# EAGLE board PCB - alu40 (EAGLE 9.6.2)
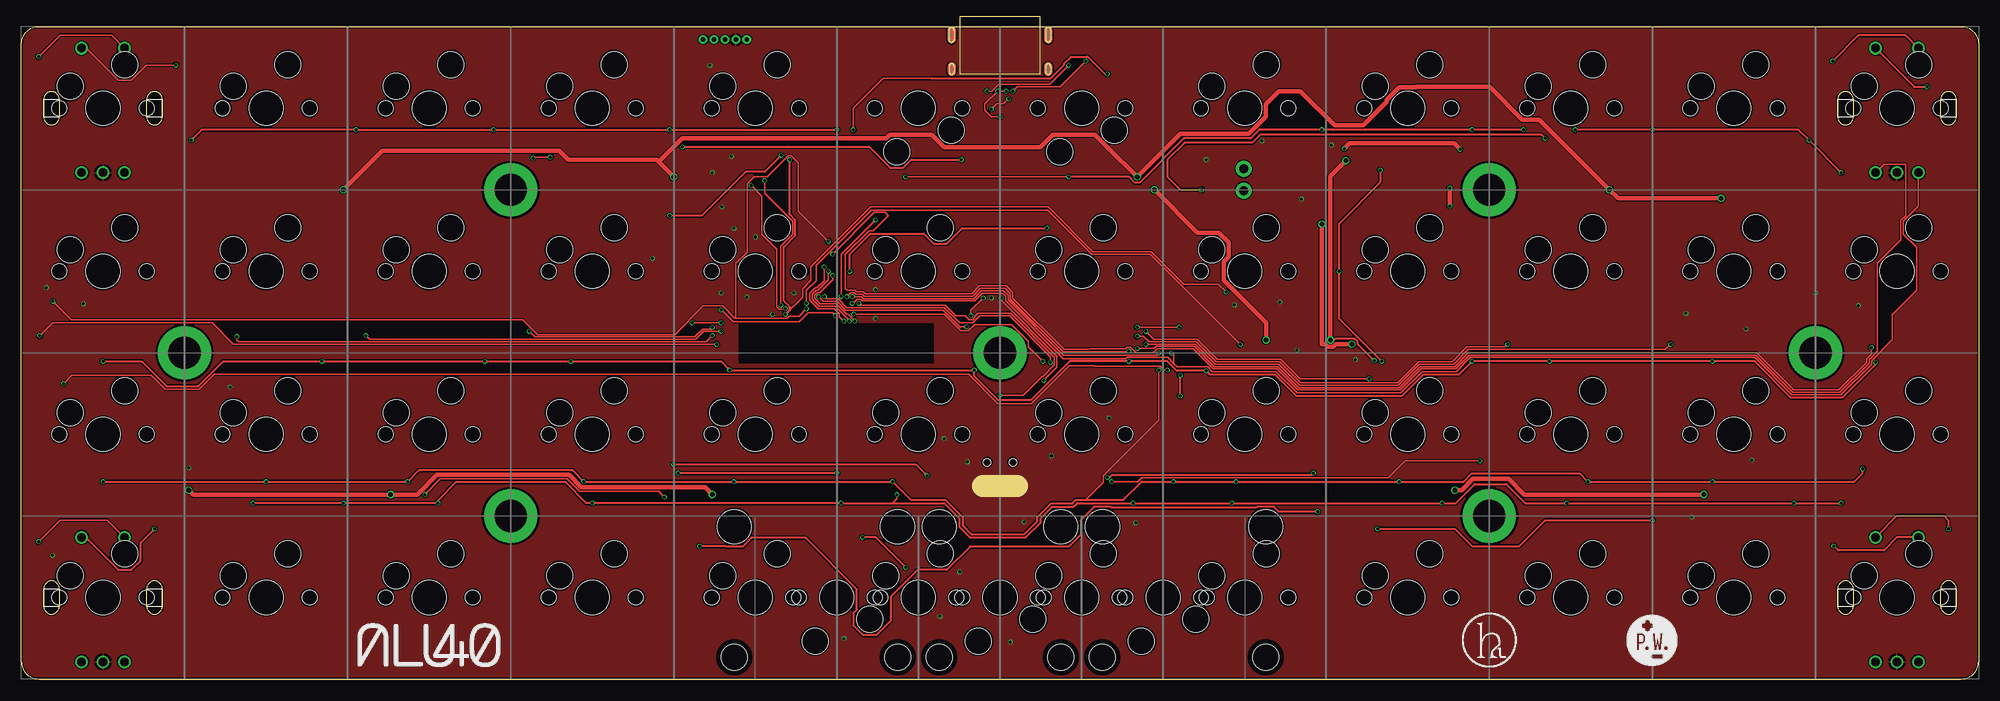
[diagram p2: board, top side]
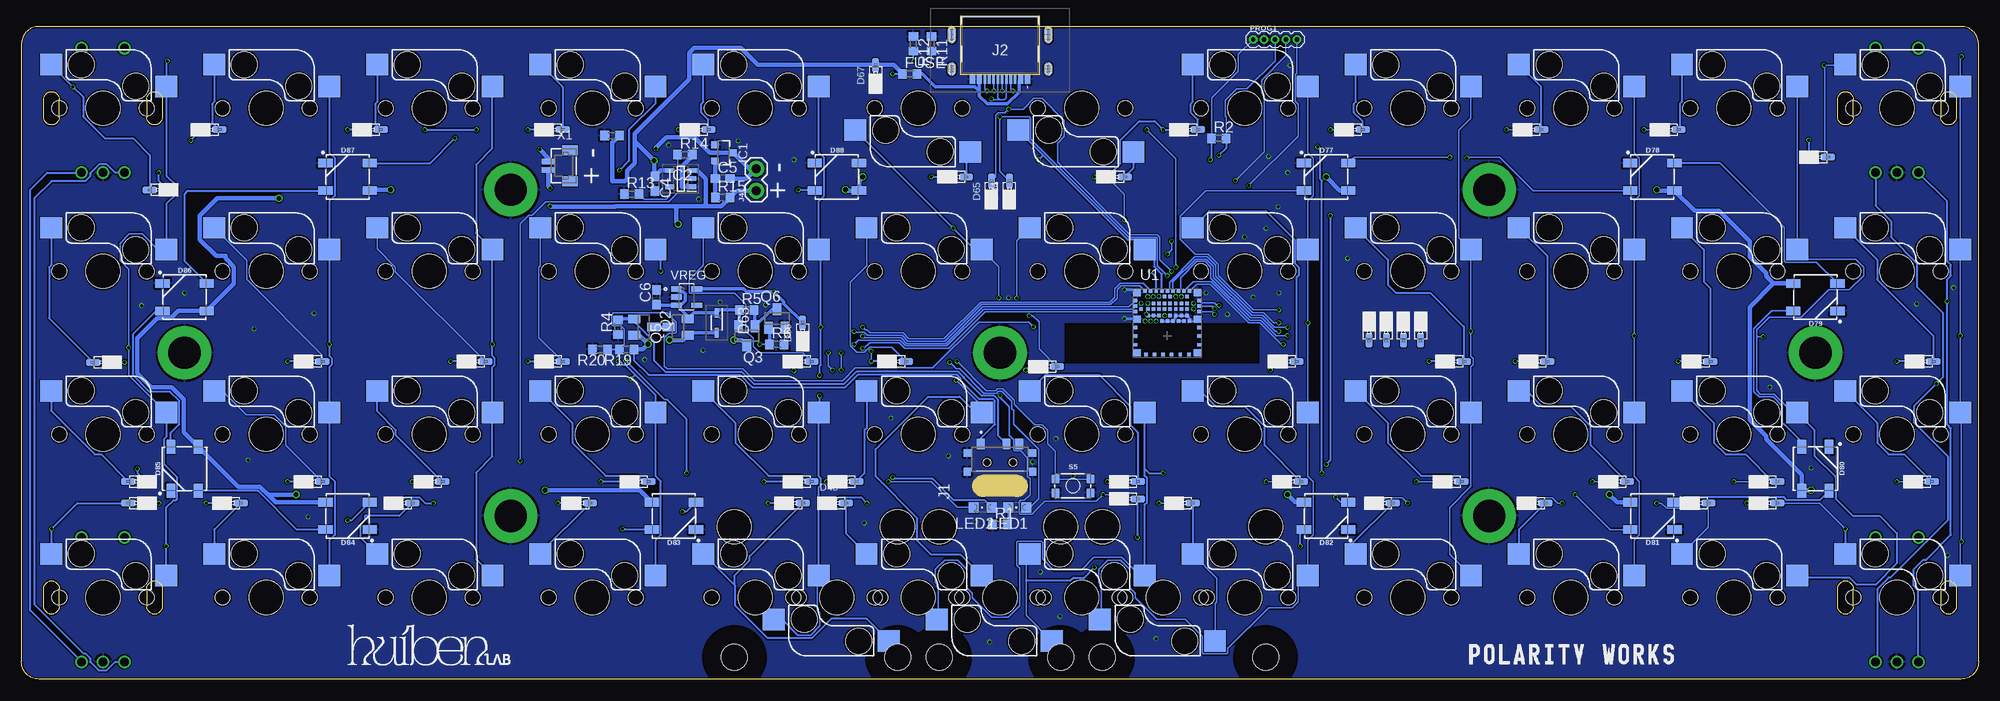
[diagram p3: board, bottom side, seen from below]

Size 228 x 76 mm. Coordinates in mm from the lower left corner, seen from the top.
Outline: 2,0 226,0 arc90 228,2 228,74 arc90 226,76 2,76 arc90 0,74 0,2 arc90 2,0
Copper layers (1*16): Top 0.035559375mm / dielectric 1.6mm / Bottom 0.035559375mm
Design rules "jlcpcb2layer": minimum track width 5mil, minimum drill 12mil, track to track 5mil, track to pad 5mil, pad to pad 5mil, via to via 5mil, smd to smd 5mil, copper to edge 8mil, drill to drill 6mil, minimum pad ring 5mil, minimum via ring 3mil, stop-mask expansion 2.5mil, vias tented up to drill 0mil, thermal gap 10mil
tRestrict: area 83.6,36.8 to 106.3,41.5; 1 lines
bRestrict: area 83.8,36.8 to 106.5,41.5; 1 lines
Milling: 1 lines

## Footprints (pad centres in the part's own frame; a part is rotated, then mirrored left to right if it is on the bottom)
CHERRY = smd 2.55 x 2.5 bottom: 1 6.05,5.08; 2 -7.37,2.54 | hole 3.988: 0,0 | hole 1.753: 5.08,0; -5.08,0 | hole 3.048: -3.81,2.54; 2.54,5.08
ENCODER = drill 0.991: A -2.5,-7.5; B 2.5,-7.5; GND 0,-7.5; S1 -2.5,7; S2 2.5,7
C0603 = smd 1.1 x 1: 1 -0.85,0; 2 0.85,0
SOD-323 = smd 1.676 x 0.813: A 1.04,0; C -1.04,0
SOD2713X115N = smd 1.125 x 0.5: 1 -1.162,0; 2 1.162,0
WS2812B = smd 1.651 x 1: 1 2.577,-1.6; 2 2.577,1.6; 3 -2.577,1.6; 4 -2.577,-1.6
R0603 = smd 1 x 1.1: 1 -0.85,0; 2 0.85,0
SOT23-3 = smd 0.8 x 0.9: 1 -0.95,-1; 2 0.95,-1; 3 0,1.1
SOT95P280X100-5N = smd 1.05 x 0.55: 1 -1.3,0.95; 2 -1.3,0; 3 -1.3,-0.95; 4 1.3,-0.95; 5 1.3,0.95
SK3296S01L1 = smd 0.9 x 1.2: 1 2.25,-0.9; 2 -0.75,-0.9; 3 -2.25,-0.9 | smd 0.8 x 0.9: MP1 -3.8,0.15; MP2 3.8,0.15; MP3 3.8,2.35; MP4 -3.8,2.35 | hole 0.9: -1.5,1.25; 1.5,1.25
USB4510031A = smd 0.6 x 1.1: A1 -3.2,4; A4 -2.4,4; A9 2.4,4; A12 3.2,4 | smd 0.3 x 1.1: A5 -1.25,4; A6 -0.25,4; A7 0.25,4; A8 1.25,4; B5 1.75,4; B6 0.75,4; B7 -0.75,4; B8 -1.75,4 | smd 1 x 1.6: SHLD1 5.621,2.834; SHLD5 -5.622,2.834 | smd 1 x 1.6 bottom: SHLD2 5.621,2.834; SHLD6 -5.622,2.834 | smd 1 x 2.1: SHLD3 -5.646,-1.161; SHLD7 5.62,-1.161 | smd 1 x 2.1 bottom: SHLD4 -5.646,-1.161; SHLD8 5.62,-1.161
1X02 = drill 1.016 pad 1.88: 1 0,0; 2 2.54,0
CHIPLED_0805 = smd 1.2 x 1.2: A 0,-1.05; C 0,1.05
1X05_1.27MM = drill 0.508 pad 1: 1 0,0; 2 1.27,0; 3 2.54,0; 4 3.81,0; 5 5.08,0
SOT23 = smd 1 x 1.4: 1 -0.95,-1.1; 2 0.95,-1.1; 3 0,1.1
TACTILE_SWITCH_SMD_4.6X2.8MM = smd 0.9 x 1: 1 -2.05,-0.8; 2 2.05,-0.8; 3 2.05,0.8; 4 -2.05,0.8
ISP1807-LR = smd 0.8 x 0.8: 1 0.5,-0.5; 7 0.5,-3.6; 25 7.5,-3.6; 31 7.5,-0.5; 68 0.5,-7.5; 75 7.5,-7.5 | smd 0.4 x 0.4: 2 0.3,-1.4; 3 0.95,-1.725; 4 0.3,-2.05; 5 0.95,-2.375; 6 0.3,-2.7; 8 1.4,-3.8; 9 1.725,-3.15; 10 2.05,-3.8; 11 2.375,-3.15; 12 2.7,-3.8; 13 3.025,-3.15; 14 3.35,-3.8; 15 3.675,-3.15; 16 4,-3.8; 17 4.325,-3.15; 18 4.65,-3.8; 19 4.975,-3.15; 20 5.3,-3.8; 21 5.625,-3.15; 22 5.95,-3.8; 23 6.275,-3.15; 24 6.6,-3.8; 26 7.7,-2.7; 27 7.05,-2.375; 28 7.7,-2.05; 29 7.05,-1.725; 30 7.7,-1.4; 32 6.6,-0.3; 33 6.275,-0.95; 34 5.95,-0.3; 35 5.625,-0.95; 36 5.3,-0.3; 37 4.975,-0.95; 38 4.65,-0.3; 39 4.325,-0.95; 40 4,-0.3; 41 3.675,-0.95; 42 3.35,-0.3; 43 3.025,-0.95; 44 2.7,-0.3; 45 2.375,-0.95; 46 2.05,-0.3; 47 1.725,-0.95; 48 1.4,-0.3; 49 6.275,-1.725; 50 5.625,-1.725; 51 4.975,-1.725; 52 4.325,-1.725; 53 3.675,-1.725; 54 3.025,-1.725; 55 2.375,-1.725; 56 1.725,-1.725; 57 6.275,-2.375; 58 5.625,-2.375; 59 4.975,-2.375; 60 4.325,-2.375; 61 3.675,-2.375; 62 3.025,-2.375; 63 2.375,-2.375; 64 1.725,-2.375; 65 0.3,-4.55; 66 0.3,-5.55; 67 0.3,-6.55; 69 1.5,-7.7; 70 2.5,-7.7; 71 3.5,-7.7; 72 4.5,-7.7; 73 5.5,-7.7; 74 6.5,-7.7; 76 7.7,-6.55; 77 7.7,-5.55; 78 7.7,-4.55
SINSOOM2 = drill 3.75 pad 6.2: P$1 0,0
STAB-2U = hole 3.988: -11.938,-8.255; 11.938,-8.255 | hole 3.048: -11.938,6.985; 11.938,6.985
SOT95P285X140-5N = smd 1.35 x 0.6: 1 -1.185,0.95; 2 -1.185,0; 3 -1.185,-0.95; 4 1.185,-0.95; 5 1.185,0.95
BM02B-SRSS-TB = smd 0.6 x 1.55: 1 0.5,0; 2 -0.5,0 | smd 1.2 x 1.8: M1 1.8,-2.525; M2 -1.8,-2.525

## Placement (x,y rotation side)
11  [CHERRY]  9.5,66.5 0 top
11ENC  ENCODERHOLE  [ENCODER]  9.5,66.5 0 top
12  [CHERRY]  28.5,66.5 0 top
13  [CHERRY]  47.5,66.5 0 top
14  [CHERRY]  66.5,66.5 0 top
15  [CHERRY]  85.5,66.5 0 top
16  [CHERRY]  104.5,66.5 180 top
17  [CHERRY]  123.5,66.5 180 top
18  [CHERRY]  142.5,66.5 0 top
19  [CHERRY]  161.5,66.5 0 top
21  [CHERRY]  9.5,47.5 0 top
22  [CHERRY]  28.5,47.5 0 top
23  [CHERRY]  47.5,47.5 0 top
24  [CHERRY]  66.5,47.5 0 top
25  [CHERRY]  85.5,47.5 0 top
26  [CHERRY]  104.5,47.5 0 top
27  [CHERRY]  123.5,47.5 0 top
28  [CHERRY]  142.5,47.5 0 top
29  [CHERRY]  161.5,47.5 0 top
31  [CHERRY]  9.5,28.5 0 top
32  [CHERRY]  28.5,28.5 0 top
33  [CHERRY]  47.5,28.5 0 top
34  [CHERRY]  66.5,28.5 0 top
35  [CHERRY]  85.5,28.5 0 top
36  [CHERRY]  104.5,28.5 0 top
37  [CHERRY]  123.5,28.5 0 top
38  [CHERRY]  142.5,28.5 0 top
39  [CHERRY]  161.5,28.5 0 top
41  [CHERRY]  9.5,9.5 0 top
41ENC\  ENCODERHOLE  [ENCODER]  9.5,9.5 0 top
42  [CHERRY]  28.5,9.5 0 top
43  [CHERRY]  47.5,9.5 0 top
44  [CHERRY]  66.5,9.5 0 top
45  [CHERRY]  85.5,9.5 0 top
45-2  [CHERRY]  95,9.5 180 top
46  [CHERRY]  104.5,9.5 0 top
46-2  [CHERRY]  114,9.5 180 top
47  [CHERRY]  123.5,9.5 0 top
48  [CHERRY]  142.5,9.5 0 top
48-2  [CHERRY]  133,9.5 180 top
49  [CHERRY]  161.5,9.5 0 top
110  [CHERRY]  180.5,66.5 0 top
111  [CHERRY]  199.5,66.5 0 top
112  [CHERRY]  218.5,66.5 0 top
112ENC  ENCODERHOLE  [ENCODER]  218.5,66.5 0 top
210  [CHERRY]  180.5,47.5 0 top
211  [CHERRY]  199.5,47.5 0 top
212  [CHERRY]  218.5,47.5 0 top
310  [CHERRY]  180.5,28.5 0 top
311  [CHERRY]  199.5,28.5 0 top
312  [CHERRY]  218.5,28.5 0 top
410  [CHERRY]  180.5,9.5 0 top
411  [CHERRY]  199.5,9.5 0 top
412  [CHERRY]  218.5,9.5 0 top
412ENC  ENCODERHOLE  [ENCODER]  218.5,9.5 0 top
C4  10u  [C0603]  154.2,57.7 270 bottom
C5  100n  [C0603]  146.3,58.3 0 bottom
C6  4.7u  [C0603]  154,44.5 90 bottom
D1  1N4148WS  [SOD-323]  18.6,60.8 0 bottom
D2  1N4148WS  [SOD-323]  36,64 0 bottom
D3  1N4148WS  [SOD-323]  52,64 0 bottom
D4  1N4148WS  [SOD-323]  72.8,64 0 bottom
D5  1N4148WS  [SOD-323]  92,64 0 bottom
D6  1N4148WS  [SOD-323]  100.5,58.5 0 bottom
D7  1N4148WS  [SOD-323]  119,58.5 0 bottom
D8  1N4148WS  [SOD-323]  149,64 0 bottom
D9  1N4148WS  [SOD-323]  166,64 0 bottom
D10  1N4148WS  [SOD-323]  187.2,64 0 bottom
D11  1N4148WS  [SOD-323]  206,64 0 bottom
D12  1N4148WS  [SOD-323]  212,57 180 bottom
D13  1N4148WS  [SOD-323]  6.3,37 0 bottom
D14  1N4148WS  [SOD-323]  32.3,37 0 bottom
D15  1N4148WS  [SOD-323]  51.3,37 0 bottom
D16  1N4148WS  [SOD-323]  61,37 0 bottom
D17  1N4148WS  [SOD-323]  80.5,37 0 bottom
D18  1N4148WS  [SOD-323]  108.4,36.4 0 bottom
D19  1N4148WS  [SOD-323]  126,37 0 bottom
D20  1N4148WS  [SOD-323]  137,37 0 bottom
D21  1N4148WS  [SOD-323]  166,37 0 bottom
D22  1N4148WS  [SOD-323]  175,37 0 bottom
D23  1N4148WS  [SOD-323]  194,37 0 bottom
D24  1N4148WS  [SOD-323]  218.6,36.9 180 bottom
D25  1N4148WS  [SOD-323]  6.5,23 0 bottom
D26  1N4148WS  [SOD-323]  24.5,23 0 bottom
D27  1N4148WS  [SOD-323]  42,23 0 bottom
D28  1N4148WS  [SOD-323]  61.3,23 0 bottom
D29  1N4148WS  [SOD-323]  80,23 0 bottom
D30  1N4148WS  [SOD-323]  99,23 0 bottom
D31  1N4148WS  [SOD-323]  131.8,23 0 bottom
D32  1N4148WS  [SOD-323]  137,23 0 bottom
D33  1N4148WS  [SOD-323]  156,23 0 bottom
D34  1N4148WS  [SOD-323]  180,23 0 bottom
D35  1N4148WS  [SOD-323]  194,23 0 bottom
D36  1N4148WS  [SOD-323]  214.5,23 180 bottom
D37  1N4148WS  [SOD-323]  24.5,20.5 0 bottom
D38  1N4148WS  [SOD-323]  32.5,20.5 0 bottom
D39  1N4148WS  [SOD-323]  51.5,20.5 0 bottom
D40  1N4148WS  [SOD-323]  69.3,20.5 0 bottom
D41  1N4148WS  [SOD-323]  92.6,20.5 0 bottom
D42  1N4148WS  [SOD-323]  99,21 0 bottom
D43  1N4148WS  [SOD-323]  138,20.5 0 bottom
D44  1N4148WS  [SOD-323]  162.8,20.5 0 bottom
D45  1N4148WS  [SOD-323]  183.5,20.5 0 bottom
D46  1N4148WS  [SOD-323]  203.5,20.5 0 bottom
D47  1N4148WS  [SOD-323]  214.5,20.5 180 bottom
D48  1N4148WS  [SOD-323]  133,20.5 0 bottom
D49  1N4148WS  [SOD-323]  65,40.5 270 bottom
D50  1N4148WS  [SOD-323]  67,40.5 270 bottom
D51  1N4148WS  [SOD-323]  69,40.5 270 bottom
D52  1N4148WS  [SOD-323]  71,40.5 270 bottom
D63  SD103AWS-E3-08  [SOD2713X115N]  147,41.5 270 bottom
D64  ESDSOD323  [SOD-323]  112.9,57 90 bottom
D65  ESDSOD323  [SOD-323]  115,57 90 bottom
D66  ESDSOD323  [SOD-323]  137,40.5 90 bottom
D67  ESDSOD323  [SOD-323]  128.5,70.5 90 bottom
D77  WS2812B  [WS2812B]  76,58.5 0 bottom
D78  WS2812B  [WS2812B]  38,58.5 0 bottom
D79  WS2812B  [WS2812B]  19,44.5 180 bottom
D80  WS2812B  [WS2812B]  19,24.5 270 bottom
D81  WS2812B  [WS2812B]  38,19 180 bottom
D82  WS2812B  [WS2812B]  76,19 180 bottom
D83  WS2812B  [WS2812B]  152,19 180 bottom
D84  WS2812B  [WS2812B]  190,19 180 bottom
D85  WS2812B  [WS2812B]  209,24.5 90 bottom
D86  WS2812B  [WS2812B]  209,44.5 0 bottom
D87  WS2812B  [WS2812B]  190,58.5 0 bottom
D88  WS2812B  [WS2812B]  133,58.5 0 bottom
FUSE  500m  [R0603]  124.5,70.5 0 bottom
IC1  XB3303ASOT23  [SOT23-3]  146.2,61.3 270 bottom
IC2  TP4054-42-SOT25-R  [SOT95P280X100-5N]  151.2,58.3 180 bottom
J1  SK-3296S-01-L1  [SK3296S01L1]  114,26.5 180 bottom
J2  USB4510-03-1-A  [USB4510031A]  114,73.9 180 bottom
J4  [1X02]  142.4,56.9 90 bottom
LED1  RED  [CHIPLED_0805]  112,20 90 bottom
LED2  [CHIPLED_0805]  116,20 90 bottom
PROG1  [1X05_1.27MM]  84.5,74.5 0 bottom
Q2  PMOSFET  [SOT23]  155.5,41 270 bottom
Q3  PMOSFET  [SOT23]  143.5,40 180 bottom
Q5  PMOSFET  [SOT23]  151.5,41 90 bottom
Q6  NMOSFET  [SOT23]  140,42 0 bottom
R1  200  [R0603]  114,18 0 bottom
R2  100k  [R0603]  88.5,63 0 bottom
R4  100k  [R0603]  158.5,41 90 bottom
R5  100k  [R0603]  143.5,43 0 bottom
R6  100k  [R0603]  140,39 0 bottom
R11  5.1k  [R0603]  122,74 270 bottom
R12  5.1k  [R0603]  124.1,74 270 bottom
R13  2k  [R0603]  156.9,56.5 0 bottom
R14  1.2k  [R0603]  150.7,61.1 0 bottom
R15  100  [R0603]  146.3,56.1 0 bottom
R17  100k  [R0603]  159.2,63.3 0 bottom
R19  100K  [R0603]  157.5,38.4 180 bottom
R20  100k  [R0603]  160.6,38.4 180 bottom
S5  MOMENTARY-SWITCH-SPST-SMD-4.6X2.8MM  [TACTILE_SWITCH_SMD_4.6X2.8MM]  105.5,22.5 0 bottom
U1  ISP1807-LRISP1807-LR_ISP1807-LR  [ISP1807-LR]  98.5,45.5 0 bottom
U$1  SINSOOM2  [SINSOOM2]  19,38 0 top
U$2  SINSOOM2  [SINSOOM2]  57,57 0 top
U$3  SINSOOM2  [SINSOOM2]  57,19 0 top
U$4  SINSOOM2  [SINSOOM2]  114,38 0 top
U$5  SINSOOM2  [SINSOOM2]  171,57 0 top
U$6  SINSOOM2  [SINSOOM2]  171,19 0 top
U$7  SINSOOM2  [SINSOOM2]  209,38 0 top
U$8  STAB-2U  [STAB-2U]  95,9.5 180 top
U$9  STAB-2U  [STAB-2U]  114,9.5 180 top
U$10  STAB-2U  [STAB-2U]  133,9.5 180 top
VREG  AP2112K-3.3TRG1  [SOT95P285X140-5N]  150.5,44.5 0 bottom
X1  BM02B-SRSS-TB  [BM02B-SRSS-TB]  166.6,59.8 90 bottom

## Tracks (layer width: path | path; a pad name or v marks a point on that pad's centre or on a via)
A  (via drill 0.35)
  Top 0.152: U1.27 90.61,42.28 89.44,42.28 89.19,42.03 83.12,42.03 | 83.12,42.03 81.69,43.47 79.44,43.47 76.11,40.14 60.15,40.14 58.42,41.87 5.79,41.87 v3.66,44 | 112ENC.A 217,60 219.5,60 219.5,53.99 218.96,53.44 218.96,51.17 216.23,48.44 216.23,38.18 215.25,37.21 215.25,36.82 211.85,33.41 206.35,33.41 202.02,37.74 168.69,37.74 167.07,36.13 163.1,36.13 160.66,33.68 148.68,33.68 146.24,36.13 138.83,36.13 136.49,38.47 132.31,38.47 131.87,38.02 129.84,38.02 129.19,38.68 128.81,38.68 128.63,38.5 124.5,38.5 124.42,38.42 121.46,38.42 115.49,44.39 115.49,45.01 114.7,45.8 111.61,45.8 110.7,44.89 98.28,44.89 98.06,45.11 97.3,45.11 97.11,45.3 96.2,45.3 96,45.5 96,49.47 98.76,52.22 99.22,52.22 101,54 100.64,54.36 99.36,54.36 v94.5,49.5 | 83.12,42.03 83.23,42.14 83.23,48.44 84.53,49.75 84.53,57.69 85.39,58.55 86.89,58.55 89.31,60.97 89.69,60.97 90.5,60.16 90.5,54.5 v94,51
  Bottom 0.152: v94.5,49.5 94,50 v94,51
  Bottom 0.254: 41ENC\.A 7,10.31 7.54,10.85 7.54,12.81 6.46,13.89 6.11,13.89 3.21,16.79 3.21,29.24 3.66,29.68 v3.66,44 3.66,46.55 3.21,47 3.21,48.24 3.66,48.69 3.66,55.66 11ENC.A | 112ENC.A 217.09,59 218.09,60 218.91,60 220,58.91 220,58.59 220.59,58 224.5,58 226.5,56 226.5,8.7 220.79,3 220.59,3 220,2.41 220,2 219,1 218.09,1 217.09,2 412ENC.A | U1.27
  other vias: 91.45,43.12
B  (via drill 0.35)
  Top 0.152: U1.56 96.89,43.77 97.36,44.24 97.74,44.24 97.93,44.05 111.05,44.05 111.95,44.96 114.28,44.96 114.66,44.59 114.66,44.05 121.37,37.33 128.67,37.33 128.81,37.47 133.53,37.47 134.25,36.75 | 134.25,36.75 134.63,36.37 138.19,36.37 138.73,35.83 146.14,35.83 148.64,33.33 160.7,33.33 163.2,35.83 167.17,35.83 168.81,37.47 201.9,37.47 206.24,33.13 211.96,33.13 215.53,36.7 215.53,37.09 217.95,39.51 217.95,42.45 220.77,45.27 220.77,50.3 219.24,51.83 219.24,53.33 221,55.09 112ENC.B | 134.25,36.75 134.25,37.75 v134,38 | v133.5,36 133.16,36 132.69,36.47 125.03,36.47 125,36.5 122.07,36.5 117.64,32.07 113.76,32.07 110.33,35.5 22.47,35.5 20.74,33.77 16.76,33.77 15.15,35.38 5.88,35.38 v4.93,34.43
  Bottom 0.152: v134,38 134,36.5 v133.5,36
  Bottom 0.254: 11ENC.B 12,55.16 10.19,53.35 10.19,51.47 7.18,48.46 7.18,45.68 4.17,42.67 4.17,35.18 v4.93,34.43 7.54,31.81 7.54,29.92 3.6,25.97 3.6,18.5 10.27,11.82 10.46,11.82 11.82,10.46 11.82,2.18 41ENC\.B | 412ENC.B 227,8 227,57 225,59 112ENC.B
  other vias: 96.78,43.77
BLED  (via drill 0.35)
  Top 0.152: U1.37 93.79,44.28 95.13,44.28 96.13,43.28 107.51,43.28 109.29,41.5 110.84,41.5 111.66,42.32 115.13,42.32 119.88,37.57 v119.88,36.9
  Bottom 0.152: U1.37 | LED1.A 110.5,20 109.5,21 109.5,26.79 110.06,27.34 110.74,28.02 112.4,29.69 112.4,31.3 112.62,31.52 112.62,32.34 113.79,33.51 114.18,33.51 114.38,33.31 115.88,33.31 118.71,36.15 119.12,36.15 v119.88,36.9
  other vias: 93.53,44.55
BVOLT  (via drill 0.35)
  Top 0.152: U1.35 93.06,44.36 93.41,44 95.01,44 96.03,42.99 107.41,42.99 109.4,41 109.42,41.02 v110.12,41.02
  Bottom 0.152: R19.2 157.75,39 157.75,40.73 158.16,41.15 159.13,41.15 159.25,41.27 159.25,42.43 159.03,42.65 152.77,42.65 151.7,41.58 151.7,40.42 151.82,40.3 152.57,40.3 153.12,39.76 153.12,36.47 152.79,36.15 143.98,36.15 142.59,34.76 132.33,34.76 130.85,36.24 121.81,36.24 116.49,41.57 110.67,41.57 v110.12,41.02
  Bottom 0.254: R20.1 R19.2
  other vias: 92.88,44.55
COL0  (via drill 0.35)
  Top 0.152: v81,39 24.7,39 22.2,41.5 3.63,41.5 v2.13,40
  Top 0.203: 41ENC\.S2 10,18.5 4.5,18.5 v2,16 | 11ENC.S2 10.5,75 4.5,75 v2,72.5
  Bottom 0.152: U1.32 91.1,46 89.5,46 85.03,41.53 83.74,41.53 81.21,39 v81,39
  Bottom 0.203: 41.2 2.13,15.87 v2,16 2,30.91 31.2 v2.13,40 21.2 11.2 2.13,72.37 v2,72.5
COL1  (via drill 0.35)
  Top 0.152: v80.5,40 79.8,39.3 25.3,39.3 25.1,39.49 v25.1,39.9
  Bottom 0.152: U1.34 92.3,45.45 92.3,45.48 91.51,46.28 89.38,46.28 84.92,41.81 83.63,41.81 81.82,40 v80.5,40 | v25.1,39.9 25.86,39.9
  Bottom 0.203: 12.2 22.2 19.98,48.89 14.3,48.89 13.4,47.99 13.4,47.01 15.04,45.37 17.46,45.37 20.66,42.17 24.36,42.17 25.86,40.67 25.86,39.9 25.86,33.64 25.42,33.2 23.8,33.2 21.64,31.04 32.2
  Bottom 0.254: 32.2 19.13,29.04 19.13,26.04 16.65,23.56 16.65,21 14.65,19 11.5,19 9.5,17 9.5,13.5 12,11 14.2,11 14.98,11.78 20.87,11.78 42.2
COL2  (via drill 0.35)
  Top 0.152: v81.5,40.5 79.5,40.5 78.58,39.58 40.55,39.58 v40.13,40
  Bottom 0.152: U1.36 92.95,45.45 92.95,46.76 91.06,48.66 90.1,48.66 89.42,47.98 89.42,46.72 84.8,42.09 83.51,42.09 81.92,40.5 v81.5,40.5
  Bottom 0.203: 13.2 40.13,61.3 39.52,60.7 39.52,56.3 40.13,55.7 23.2 v40.13,40 33.2 40.13,23.62 39.52,23.01 39.52,16.8 40.13,16.2 43.2
COL3  (via drill 0.35)
  Top 0.152: v80.5,40.97 80.31,40.78 79.38,40.78 78.46,39.86 59.77,39.86 v59.13,40.5
  Bottom 0.152: U1.38 93.85,46.26 91.17,48.94 89.99,48.94 89.14,48.09 89.14,46.83 84.68,42.37 83.39,42.37 82.03,41 80.53,41 v80.5,40.97
  Bottom 0.203: 44.2 61.63,14.54 61.63,19.94 59.13,22.44 34.2 59.13,36.38 58.89,36.62 58.89,37.38 59.13,37.62 v59.13,40.5 24.2 60.53,51.44 60.53,63.94 59.13,65.34 14.2
COL4  (via drill 0.35)
  Top 0.152: v81.5,41.5 v78.13,41.5
  Bottom 0.152: U1.40 94.25,45.45 94.25,46.25 91.29,49.22 89.87,49.22 88.86,48.21 88.86,46.95 84.57,42.65 83.28,42.65 82.13,41.5 v81.5,41.5
  Bottom 0.203: 15.2 78.13,61.3 77.52,60.7 77.52,56.3 78.13,55.7 25.2 v78.13,41.5 35.2 78.13,23.62 77.52,23.01 77.52,16.8 78.13,16.2 45.2 79.24,10.93 79.24,9.01 79.93,8.32 82.7,8.32 87.45,3.57 87.45,3.08 87.58,2.94 90.32,2.94 90.45,3.08 90.45,5 92.41,6.96 95.71,6.96 98.24,9.49 98.24,9.99 98.86,10.61 98.86,12.8 99.93,13.87 101.45,13.87 102.52,12.8 102.52,11.28 102.2,10.96 102.2,7.13 45-2.2
COL5  (via drill 0.35)
  Top 0.254: v95,24 v76.5,24 | v77,62 89.27,62 89.29,62.02 98.74,62.02 101.19,59.57 102.73,59.57 103.66,60.5 v109.5,60.5
  Bottom 0.203: 46.2 97.64,12.04 99.8,14.2 103.05,14.2 104.5,12.75 107.8,12.75 109.05,14 109.05,15.93 109.18,16.06 111.92,16.06 112.05,15.93 112.05,13.23 111.7,12.88 111.7,8.55 113.05,7.2 114.95,7.2 117.24,9.49 117.24,9.99 117.86,10.61 117.86,12.8 118.93,13.87 120.45,13.87 121.52,12.8 121.52,11.28 121.2,10.96 121.2,7.13 46-2.2
  Bottom 0.254: 46.2 97.13,20.34 96.87,20.61 96.87,23.39 97.13,23.66 97.13,24.5 | 97.13,24.5 36.2 | U1.42 95.15,47.18 95.98,48.02 95.98,48.89 26.2 98.25,51.16 99.11,51.16 108.97,61.03 | 97.13,24.5 96.63,24 v95,24 | v76.5,24 76.5,58.06 76.67,58.22 76.67,61.67 v77,62 | 108.97,61.03 110.72,62.78 110.72,62.81 16.2 | v109.5,60.5 108.97,61.03
COL6  (via drill 0.35)
  Top 0.152: v114.12,44.42 114.12,44.12 120.62,37.62 120.62,36.33 v119.1,34.8
  Top 0.254: v96.5,47.5 96.5,49.5 98.89,51.89 105.1,51.89 106.27,50.73 107.81,50.73 109.63,52.55 v119.45,52.55
  Bottom 0.152: 37.2 116.13,31.83 v119.1,34.8 | v114.12,44.42 114.12,48.03 27.2
  Bottom 0.254: 17.2 v119.45,52.55 116.95,50.04 27.2 | 47.2 118.59,14.5 122,14.5 123.61,16.11 123.61,18.72 128.5,23.6 128.5,26.79 122.39,32.9 118.7,32.9 116.84,31.04 37.2 | U1.44 95.8,46.8 v96.5,47.5
COL7  (via drill 0.35)
  Top 0.152: v130,41 v134.87,41
  Top 0.254: v135,33 v135,35.38
  Bottom 0.152: U1.46 96.7,45.45 96.7,45.48 97.32,46.1 100.01,46.1 100.64,45.47 100.64,44.5 101.23,43.92 116.26,43.92 120.54,39.64 124.61,39.64 125.28,40.32 129.13,40.32 129.5,40.69 129.69,40.69 v130,41
  Bottom 0.203: 48.2 135.3,11.87 135.3,8.04 134.98,7.72 134.98,6.2 136.05,5.13 137.57,5.13 139.4,6.96 48-2.2
  Bottom 0.254: 48.2 135.13,20.11 135.13,22.34 134.87,22.61 134.87,23.39 135.13,23.66 38.2 135,31.17 v135,33 | 18.2 135.13,61.34 134.5,60.7 134.5,56.3 135.13,55.66 28.2 134.87,49.78 v134.87,41 134.87,36.61 135,36.48 v135,35.38
COL8  (via drill 0.35)
  Top 0.152: v157,34.98 148.96,34.98 146.7,37.24 139.29,37.24 136.95,39.58 131.92,39.58 v131,40.5
  Top 0.254: v158.5,37 153.5,42 v153.5,47.5 153.5,53.06 158.32,57.88 158.32,59.28 v158.3,59.3
  Bottom 0.152: U1.48 97.11,45.2 97.74,45.82 99.89,45.82 100.37,45.35 100.37,44.37 101.1,43.64 116.15,43.64 120.42,39.37 124.73,39.37 125.4,40.04 129.5,40.04 129.53,40.07 129.53,40.14 129.81,40.41 130.91,40.41 v131,40.5 | v157,34.98 156.52,35.47 156.52,35.48
  Bottom 0.254: 49.2 154.13,16.16 153.5,16.8 153.5,23.02 154.13,23.66 39.2 154.13,33.09 156.52,35.48 157.62,36.58 157.81,36.58 158.23,37 v158.5,37 | v153.5,47.5 153.5,49.41 29.2 | v158.3,59.3 157.23,60.37 157.23,63.99 154.13,67.08 19.2
COL9  (via drill 0.35)
  Top 0.152: v130,39.95 130.71,39.95 131.38,39.28 131.94,39.28 131.96,39.3 136.84,39.3 139.17,36.97 146.58,36.97 149.03,34.52 160.31,34.52 162.75,36.97 166.66,36.97 168.4,38.7 172.83,38.7 v173.13,39
  Bottom 0.152: U1.2 98.45,43.85 98.48,43.85 98.98,43.36 116.03,43.36 120.31,39.09 124.84,39.09 125.52,39.76 129.81,39.76 v130,39.95
  Bottom 0.254: 410.2 175.03,13.94 175.03,24.04 173.13,25.94 310.2 173.13,36.34 172.87,36.61 172.87,37.39 173.13,37.66 v173.13,39 210.2 175.03,51.94 175.03,59.94 173.13,61.84 110.2
COL10  (via drill 0.35)
  Top 0.152: v131,39 132.05,39 132.08,39.02 136.72,39.02 139.06,36.69 146.47,36.69 148.91,34.24 160.43,34.24 162.87,36.69 166.84,36.69 168.56,38.4 191.53,38.4 v192.13,39
  Bottom 0.152: U1.4 98.45,43.2 98.48,43.2 98.61,43.08 115.92,43.08 120.19,38.81 124.96,38.81 125.63,39.48 130.52,39.48 v131,39
  Bottom 0.254: 111.2 192.13,61.34 191.5,60.7 191.5,56.3 192.13,55.66 211.2 v192.13,39 192.13,37.66 191.87,37.39 191.87,36.61 192.13,36.34 311.2 192.13,23.66 191.5,23.02 191.5,16.8 192.13,16.16 411.2
COL11  (via drill 0.35)
  Top 0.152: v130.01,38.51 131.96,38.51 132.19,38.74 136.6,38.74 138.94,36.41 146.35,36.41 148.8,33.96 160.54,33.96 162.99,36.41 166.96,36.41 168.58,38.02 202.13,38.02 206.47,33.69 211.73,33.69 214.98,36.93 214.98,37.32 215.51,37.86 v215.51,38.6
  Top 0.254: 112ENC.S2 219.5,75 214,75 v211,72 | 412ENC.S2 218.5,16.5 217,15 211.63,15 v211.13,15.5
  Bottom 0.152: v130.01,38.51 129.85,38.51 129.19,39.18 125.72,39.18 125.07,38.53 119.97,38.53 115.7,42.8 U1.6
  Bottom 0.2: 212.2 212.11,50.04 213.93,51.87 215.45,51.87 216.52,50.8 216.52,48.77 215.51,47.76 v215.51,38.6 215.51,35.42 312.2
  Bottom 0.254: v211,72 211.13,71.87 112.2 211.13,58.66 209.87,57.39 209.87,56.61 211.13,55.34 212.2 | 312.2 211.13,28.23 211.35,28.01 211.35,25 209.85,23.49 209.85,20.99 210,20.84 210.29,20.84 211.13,20 v211.13,15.5 412.2
D+  (via drill 0.35)
  Top 0.152: v114.72,68.5 v113.72,68.5 112.22,67 112.22,66.28 113,65.5 v114,65.5 | U1.8 96.92,41.89 96.31,42.5 96.12,42.5 94.9,43.73 93.04,43.73 92.41,44.36 92.41,44.74 92.68,45.02 93,45.02 94.5,46.52 v94.5,47
  Bottom 0.152: J2.A6 113.75,68.53 v113.72,68.5 | v114.72,68.5 114.72,69.87 J2.B6 | U1.8 | v94.5,47 95.65,48.15 95.65,51.37 95.77,51.49 98.97,51.49 110.39,62.91 110.39,65.29 110.6,65.5 v114,65.5
  Bottom 0.2: v114,65.5 114,59.14 D64.A
  other vias: 97.1,41.7
D-  (via drill 0.35)
  Top 0.152: U1.10 96.27,41.89 96.27,41.96 94.78,43.45 92.93,43.45 92.13,44.24 92.13,44.86 92.57,45.3 92.8,45.3 94,46.5 v94,47.5 | v113,66.41 113.63,67.03 114.47,67.03 114.47,67.06 v115,67.59
  Bottom 0.152: J2.B7 113.25,67.75 113.5,67.5 114,67.5 | 114,67.5 114.25,67.75 J2.A7 | U1.10 | 114,67.5 114.91,67.5 v115,67.59 | v113,66.41 111.31,66.41 110.06,67.66 109.1,67.66 106.51,65.06 106.51,63.21 107.29,62.43 107.29,60.21 98.86,51.77 95.66,51.77 95.37,51.49 95.37,48.87 v94,47.5
  Bottom 0.2: D65.A 114.5,58.54 114.5,65.69 114.2,65.99 113.42,65.99 v113,66.41
  other vias: 96.45,41.7
G_BAT  (via drill 0.35)
  Top 0.508: v154.1,61.8 154.7,62.4 166.9,62.4 v167.6,61.7
  Bottom 0.508: C5.2 143.54,58.3 J4.2 143.24,59.44 IC1.3 147.8,61.3 149.6,63.1 152.9,63.1 154.1,61.9 v154.1,61.8 | X1.1 166.6,60.7 v167.6,61.7
GND  (via drill 0.35)
  Bottom 0.254: U1.14 U1.16 U1.18 93.65,41.9 93.65,42.01 93.53,42.13 U1.19 U1.21 U1.23 91.9,42.02 U1.24 91.2,41.7 U1.25
  Bottom 0.305: U1.1 98.36,45.36 v99.5,45.36 | U1.7 98.1,42 v99.5,42
  other vias: 87.5,42.5 84.5,44.5 85.5,51.5 81.5,45 83,52.5 73.5,49 80.5,59 152.6,62.2 138,60.5 214,43.5 209,45 90,45 120,26 107.5,28 110.2,25.3 113,44.4 149.1,55.9 193.9,42.6 200.9,40.8 201.6,25.5 194.6,18.9 148.6,38.3 146.6,43.9 155.4,37.2 141.3,43.6 126.7,30.4 129.8,18.2 115.2,4.3 107,7.3 109.3,12.5 95.8,4.7 3.6,14.4 24.3,34 19.5,24.6 7.2,43.7 2.9,45.6 81.6,55 82.7,60.9 80.2,71.5 144.5,62.7 116.8,18.3
  pour Bottom: 0,0 0,76 228,76 228,0
  pour Top: 0,0 0,76 228,76 228,0
N$1
  Bottom 0.254: D48.A 131.96,16.99 47.1
N$2
  Bottom 0.254: 12.1 34.55,67.24 34.79,67 34.79,64.17 D2.A
N$3
  Bottom 0.254: D3.A 50.96,68.99 13.1
N$4
  Bottom 0.254: D4.A 71.76,64.97 72.79,66 72.79,67 72.55,67.24 14.1
N$5
  Bottom 0.254: D5.A 90.96,65.17 91.79,66 91.79,67 91.55,67.24 15.1
N$6
  Bottom 0.254: 16.1 98.45,59.51 D6.A
N$7
  Bottom 0.254: 17.1 117.96,60.91 D7.A
N$8
  Bottom 0.254: D8.A 147.96,65.17 148.79,66 148.79,67 148.55,67.24 18.1
N$9
  Bottom 0.254: 19.1 164.96,68.99 D9.A
N$10
  Bottom 0.254: 110.1 186.55,67.24 186.79,67 186.79,64.63 D10.A
N$11
  Bottom 0.254: 111.1 205.55,67.24 205.79,67 205.79,64.83 D11.A
N$12  (via drill 0.35)
  Top 0.254: 112ENC.S1 220.5,69 v222,69
  Bottom 0.254: 112.1 224.55,71.55 v222,69 220.82,67.82 220.82,65.54 218.29,63 215,63 213.04,61.04 D12.A
N$13
  Bottom 0.254: 21.1 11.82,48.85 11.82,46.54 5.26,39.97 D13.A
N$14
  Bottom 0.254: D14.A 31.26,45.54 32.01,46.29 32.01,50.04 22.1
N$15
  Bottom 0.254: 23.1 50.26,49.29 D15.A
N$16
  Bottom 0.254: 24.1 68.82,48.85 68.82,45.94 67.89,45 63.9,45 59.96,41.06 D16.A
N$17
  Bottom 0.254: 25.1 89.63,54.5 83,54.5 79.66,51.16 79.66,48.45 79.21,48 79.21,47 79.46,46.75 D17.A
N$18  (via drill 0.35)
  Top 0.152: v110.61,42.33 110.61,42.95 v112.05,44.39
  Bottom 0.152: v110.61,42.33 110.17,42.33 109.45,41.61 109.45,38.49 D18.A | v112.05,44.39 112.05,51.08 26.1
N$19
  Bottom 0.152: 27.1 129.55,48.16 131.47,46.25 131.47,38.81 130.71,38.05 129.82,38.05 129.19,38.68 126.64,38.68 D19.A
N$20
  Bottom 0.152: D20.A 136.96,38 142,38
  Bottom 0.203: 142,38 142.77,38.77 142.77,39.7 143.62,40.55 143.62,43.65 144.9,44.92 150.06,44.92 150.22,45.08 150.22,46.53 148.55,48.2 28.1
N$21
  Bottom 0.152: 29.1 167.55,48.16 167.74,47.98 167.74,39.78 D21.A
N$22
  Bottom 0.152: D22.A 184.42,47.46 184.42,47.98 186.55,50.1 210.1
N$23
  Bottom 0.152: 211.1 201.77,48.8 201.77,46.56 192.96,37.74 D23.A
N$24
  Bottom 0.254: 212.1 224.55,48.24 224.79,48 224.79,42.05 D24.A
N$25
  Bottom 0.254: 31.1 11.82,29.85 11.82,27.54 10.46,26.18 8.64,26.18 D25.A
N$26
  Bottom 0.254: D26.A 23.97,23 27.15,26.18 29.46,26.18 30.82,27.54 30.82,29.85 32.1
N$27
  Bottom 0.254: D27.A 45.18,27.22 45.18,29.46 47.44,31.73 50.81,31.73 52.66,33.58 33.1
N$28
  Bottom 0.254: 34.1 68.82,29.85 68.82,27.54 64.95,23.66 61.52,23.66 60.85,23 D28.A
N$29
  Bottom 0.254: D29.A 83.18,27.22 83.18,29.46 85.44,31.73 88.81,31.73 90.66,33.58 35.1
N$30
  Bottom 0.254: 36.1 108.7,35.43 102.46,35.43 98.84,31.81 98.84,29.62 97.96,28.75 D30.A
N$31
  Bottom 0.254: 37.1 129.55,29.24 129.79,29 129.79,23.97 D31.A
N$32
  Bottom 0.254: 38.1 144.82,29.85 144.82,27.54 140.95,23.66 137.22,23.66 136.56,23 D32.A
N$33
  Bottom 0.254: 39.1 163.82,29.85 163.82,27.54 159.95,23.66 156.22,23.66 155.56,23 D33.A
N$34
  Bottom 0.254: D34.A 184.37,28.41 184.37,29 186.55,31.18 310.1
N$35
  Bottom 0.152: 311.1 204.59,33.58 201.78,30.77 198.56,30.77 197.23,29.44 197.23,27.27 D35.A
N$36
  Bottom 0.254: D36.A 218.72,26.18 219.46,26.18 224.55,31.26 312.1
N$37  (via drill 0.35)
  Top 0.2: v61.6,60.8 59.7,60.8 v59.6,60.7
  Bottom 0.2: D77.2 72.72,60.8 v61.6,60.8 | v59.6,60.7 59.5,60.8 55.8,60.8 51.9,56.9 D78.4
N$38
  Bottom 0.152: 42.1 31.46,17.67 D38.A
N$39
  Bottom 0.254: D39.A 53.55,17.41 43.1
N$40
  Bottom 0.254: D40.A 73,15.76 73,14 72.55,14.45 44.1
N$41
  Bottom 0.203: 45-2.1 88.95,8.8 88.74,9.01 88.74,11.77 91.48,14.52 45.1
  Bottom 0.254: D41.A 45.1 91.48,14.52
N$42
  Bottom 0.254: U1.22 U1.20
N$43
  Bottom 0.254: 48-2.1 129.53,7 133.68,7 135.91,4.78 141.07,4.78 144.82,8.53 144.82,10.85 144.99,11.02 | 144.99,11.02 48.1 | D43.A 143.19,14.27 143.19,13.81 144.99,12.01 144.99,11.02
N$44
  Bottom 0.254: D44.A 167.55,14.71 49.1
N$45
  Bottom 0.254: D45.A 183.96,19 188,19 188,18.51 188.5,18 188.5,16.53 410.1
N$46
  Bottom 0.254: D46.A 205.55,17.41 411.1
N$47  (via drill 0.35)
  Top 0.254: v103,13.01 99.51,16.5 v98,16.5
  Bottom 0.203: 46-2.1 110.95,7.42 110.95,11.5 110.95,14.18 46.1
  Bottom 0.254: 110.95,11.5 105.79,11.5 105.46,11.82 104.19,11.82 v103,13.01 | v98,16.5 97.96,16.54 D42.A
N$48  (via drill 0.35)
  Top 0.254: 412ENC.S1 218.5,19 224,19 224.5,18.5 v224.5,17.5
  Bottom 0.254: 412.1 224.55,17.45 v224.5,17.5 221.5,20.5 D47.A
N$49  (via drill 0.35)
  Top 0.254: 41ENC\.S1 7.5,16.5 11.27,12.73 12.81,12.73 13.89,13.81 13.89,15.89 v15.5,17.5
  Bottom 0.152: v15.5,17.5 18.5,20.5 D37.A
  Bottom 0.254: v15.5,17.5 15.55,17.45 41.1
N$50
  Bottom 0.254: LED1.C 113.05,18.1 R1.2
N$51
  Bottom 0.406: J2.A9 116.4,68.5 | 116.4,68.5 116.4,67.9 115.5,67 113.16,67 111.77,68.39 111.77,69.73 J2.A4 | 116.4,68.5 116.92,69.02 121.55,69.02 123.03,70.5 FUSE.2
N$52
  Bottom 0.508: IC1.2 147.2,58.35 C5.1 R15.1
N$53
  Bottom 0.152: IC2.5 152.5,56.28 152.9,55.88 155.43,55.88 R13.2
N$59
  Bottom 0.508: IC2.1 151.05,57.34 151.05,59.7 149.85,60.9 R14.2
N$60  (via drill 0.35)
  Top 0.152: v127,23 130.03,23 130.5,23.47 159.25,23.47 161.2,25.42 v169.9,25.42
  Bottom 0.152: LED2.C 119,20 122,23 v127,23 | v169.9,25.42 169.9,53.04 168.91,54.03 168.47,54.03 166.9,55.6 152.6,55.6 151.56,56.64 151.56,60.43 151.55,60.45 R14.1
N$61
  Bottom 0.406: Q5.3 Q2.3
N$68  (via drill 0.35)
  Top 0.152: 11ENC.S1 7.57,73.5 11.29,69.78 12.79,69.78 14.51,71.5 v18,71.5
  Bottom 0.152: 11.1 15.63,71.5 v18,71.5 17.92,71.42 17.92,61.16 D1.A
N$72  (via drill 0.35)
  Top 0.152: v122,71.5 119.78,69.28 113.84,69.28 113.06,68.5 v112.5,68.5
  Bottom 0.152: J2.A5 112.75,68.75 v112.5,68.5 | R11.2 v122,71.5
N$73  (via drill 0.35)
  Top 0.152: v115.5,68.5 116,69 121,69 v124,72
  Bottom 0.152: J2.B5 115.75,68.75 v115.5,68.5 | R12.2 124.1,72.1 v124,72
N$75
  Bottom 0.254: Q2.1 156.6,41.61 154.33,39.34 154.33,37.15 153,35.81 144.11,35.81 142.68,34.38 132.17,34.38 130.74,35.81 118.85,35.81 118.2,35.17 118.2,35.08 116.1,32.98 114.65,32.98 114.22,32.55 114.22,28.37 J1.2
  Bottom 0.406: Q2.1 158.4,41.95 R4.2
N$76
  Bottom 0.406: Q6.3 140.55,43.1 Q3.1 142.55,42.9 R5.2
N$79
  Bottom 0.152: D79.4 18.91,48.59 22.49,48.59 22.61,48.71 22.61,52.61 26.54,56.54
  Bottom 0.254: D78.2 30.1,60.1 26.54,56.54
N$80
  Bottom 0.203: 22.66,29.68 22.86,29.89 22.86,31.8 23.93,32.87 25.56,32.87 26.19,33.5 26.19,40.81 24.1,42.9 D79.2
  Bottom 0.254: D80.4 20.6,27.63 22.66,29.68
N$81
  Bottom 0.254: D81.4 34.92,20.6 34.36,21.16 22.64,21.16 22.32,20.84 18.48,20.84 D80.2
N$84  (via drill 0.35)
  Top 0.203: v74.9,21.2 74.24,21.86 65.05,21.86 63.6,23.31 48.81,23.31 v47,21.5
  Bottom 0.203: D81.2 42.9,17.4 v47,21.5 | v74.9,21.2 74.3,20.6 D82.4
N$85  (via drill 0.35)
  Top 0.254: v151,19.5 146.48,19.5 145.9,20.08 143.97,20.08 143.88,19.98 127,19.98 126.9,20.08 124.97,20.08 123.39,18.49 123.39,16.79 122.03,15.43 110.51,15.43 107.81,12.73 104.44,12.73 101.29,9.57 101.29,6.81 99.58,5.11 98.04,5.11 96.96,6.19 96.96,7.73 97.32,8.1 97.32,10.46 91.35,16.43 85.03,16.43 84.03,15.43 82.1,15.43 82.03,15.5 v79,15.5
  Bottom 0.254: D83.4 150.52,19.5 v151,19.5 | v79,15.5 79,16.98 D82.2
N$86  (via drill 0.35)
  Top 0.254: v158,17.5 167,17.5 169,15.5 174.5,15.5 177.5,18.5 v190,18.5
  Bottom 0.254: D83.2 157.9,17.4 v158,17.5 | v190,18.5 189.52,18.5 D84.4
N$87
  Bottom 0.254: D84.2 195.9,17.4 200.42,21.92 D85.4
N$89
  Bottom 0.254: D85.2 210.6,28.69 209.6,29.68 209.6,32.4 210.71,33.5 213.09,33.5 214.99,35.41 214.99,38.81 215,38.82 215,40.2 212.32,42.88 211.53,42.88 D86.4
N$90
  Bottom 0.254: D86.2 209,48.68 209,56.5 208.6,56.9 D87.4
N$91  (via drill 0.35)
  Top 0.254: v177.5,63 177.1,63.4 144.3,63.4 143.4,62.5 135.5,62.5 133.5,60.5 133.5,58.5 135,57 v137.5,57
  Bottom 0.254: D87.2 180.4,60.1 v177.5,63 | v137.5,57 135.68,57 D88.4
POWER_PIN  (via drill 0.35)
  Top 0.152: U1.29 91.45,45.27 92.57,46.4 92.57,48.23 98.98,54.64 119.57,54.64 124.72,49.5 131.5,49.5 v142,39
  Bottom 0.152: v142,39 R6.1
  Bottom 0.406: R6.1 140.85,40.8 Q6.1
  other vias: 91.45,43.77
RESET  (via drill 0.35)
  Top 0.152: v96.95,42.52 107.48,42.52 109.44,40.55 110.31,40.55 111.06,41.3 115.37,41.3 117.3,39.37 117.3,38.7 v119,37
  Top 0.254: v88.5,61 86.6,59.1 84.36,59.1 79.27,54 v75.5,54 | v75.98,25 104.2,25 v105.5,23.7
  Bottom 0.152: U1.13 U1.11 U1.9 v96.95,42.52 | PROG1.3 81.96,72.04 85.23,68.77 86.44,68.77 87.77,67.44 87.77,65.56 87.65,65.44 R2.2 | v119,37 115.59,33.59 114.49,33.59 114.29,33.79 113.67,33.79 112.34,32.46 112.34,32.04 109.96,29.66 109.1,29.66 108.42,28.98 108.42,27.42 107.55,26.55 S5.4 105.5,23.3 | S5.3 105.5,23.3 | v105.5,23.7 105.5,23.3
  Bottom 0.254: R2.2 87.65,61.85 v88.5,61 | v75.5,54 75.5,25.48 v75.98,25
ROW0  (via drill 0.35)
  Top 0.152: v95.5,44.57 95.5,49.5 v99.5,53.5 | v103,58.5 v122,58.5
  Top 0.254: v19.8,62.8 21,64 v39,64 v55,64 v75.5,64 v95,64 | v212,59 v208.25,62.75 207,64 v190,64 v181,64 | v175,64 v169,64 156.52,64 156.52,63.99 152.79,63.99 152.78,64 v151.5,64 144.2,64 143.19,62.99 135.44,62.99 130.28,57.83 129.72,57.83 129.06,58.5 v122,58.5
  Bottom 0.152: U1.43 | U1.43 v95.5,44.57 | v99.5,53.5 99.5,56.46 D6.C v103,58.5
  Bottom 0.2: D2.C v39,64 | D3.C v55,64 | D4.C v75.5,64
  Bottom 0.254: v19.8,62.8 19.8,60.96 D1.C | D5.C v95,64 96,65 97.75,65 99.98,62.77 99.98,60.06 D6.C | D12.C 212,58.04 v212,59 | v181,64 v175,64 | v151.5,64 D8.C | v122,58.5 D7.C | D9.C v169,64 | D10.C v190,64 | D11.C 208.25,62.79 v208.25,62.75
ROW1  (via drill 0.35)
  Top 0.152: v96.15,44.55 96.34,44.74 96.61,45.02 97,45.02 97.18,44.83 97.94,44.83 98.16,44.61 110.82,44.61 111.72,45.52 114.58,45.52 115.21,44.89 115.21,44.28 121.34,38.15 128.93,38.15 v129,38.21
  Top 0.254: v9.5,37 14,37 16.9,34.1 20.6,34.1 23.5,37 v35,37 v54,37 v64,37 81.5,37 v82.5,36 v111,36 111,35.3 113.8,32.5 117.6,32.5 122.1,37 v129,37 133.5,37 134.6,35.9 v138,35.9 138.4,35.5 146,35.5 148.5,33 160.84,33 163.34,35.5 167.5,35.5 v169,37 v178,37 v197,37 201.9,37 206.1,32.8 212.1,32.8 216,36.7 v216,36.9
  Bottom 0.152: U1.45 v96.15,44.55 | v129,38.21 v129,37
  Bottom 0.254: D13.C v9.5,37 | v82.5,36 81.54,36.96 D17.C | D16.C v64,37 | D15.C v54,37 | D14.C v35,37 | v216,36.9 D24.C | v169,37 D21.C | D22.C v178,37 | D23.C v197,37 | v138,35.9 138,36.96 D20.C | v111,36 110.6,36.4 D18.C | D19.C v129,37
ROW2  (via drill 0.35)
  Top 0.152: v96.8,44.55 97.5,44.55 97.53,44.52 97.86,44.52 98.05,44.33 110.93,44.33 111.84,45.24 114.4,45.24 114.93,44.71 114.93,44.16 121.4,37.7 128.64,37.7 128.69,37.74 132.25,37.74 v132.5,38 | 124,20.88 126.03,22.91 126.03,23.69 132.5,30.16 v132.5,36
  Top 0.254: v9.5,23 v28.5,23 v45,23 46.3,24.3 64.2,24.3 v65.5,23 v83,23 v101.5,23 103.62,20.88 107.64,20.88 109.64,18.88 109.64,17.9 110.66,16.88 116.84,16.88 118.36,18.4 118.36,18.88 119.94,20.46 122.42,20.46 122.84,20.88 124,20.88 128.38,20.88 130.5,23 v134.2,23 v141.5,23 v160.5,23 168,23 168.9,23.9 181.6,23.9 v182.5,23 v197,23 213.5,23 214.5,24 v214.5,24.5
  Bottom 0.152: D25.C v9.5,23 | v101.5,23 D30.C | D26.C v28.5,23 | D27.C v45,23 | D28.C v65.5,23 | D29.C v83,23 | U1.47 v96.8,44.55 | v132.5,38 v132.5,36
  Bottom 0.254: v214.5,24.5 214.5,24.04 D36.C | D35.C v197,23 | D34.C v182.5,23 | D33.C v160.5,23 | D32.C v141.5,23 | D31.C v134.2,23
ROW3  (via drill 0.35)
  Top 0.152: U1.3 97.75,43.58 107.61,43.58 108.84,42.34 109.94,42.34 110.42,41.86 110.8,41.86 111.08,42.13 111.08,42.28 111.4,42.6 115.25,42.6 120.35,37.5 120.35,36.6 119.01,35.27 118.91,35.27 116.69,33.05 v113.98,33.05 | v102,21.5 102,21 101.5,20.5
  Top 0.254: v27,20.5 v37.5,20.5 v48.5,20.5 48.5,20.8 50.6,22.9 63.4,22.9 65.8,20.5 v66.5,20.5 v95.5,20.5 101.5,20.5 107.48,20.5 109.26,18.72 109.26,17.74 110.5,16.5 117,16.5 118.74,18.24 118.74,18.72 120.1,20.08 122.03,20.08 122.05,20.05 122.55,20.05 123,20.5 v129.5,20.5 v141,20.5 v165.5,20.5 167.1,20.5 169.3,22.7 173,22.7 175.2,20.5 v180,20.5 v206.5,20.5 v212,20.5
  Bottom 0.152: D37.C v27,20.5 | v95.5,20.5 D41.C | D40.C 69.67,20.5 69.06,21.11 67.11,21.11 v66.5,20.5 | D38.C 33.91,20.5 34.51,19.9 36.33,19.9 36.94,20.5 v37.5,20.5 | D42.C 100.54,21.5 v102,21.5 102.8,20.7 108.8,20.7 110.15,19.35 110.15,19.32 110.27,19.2 111.63,19.2 111.75,19.32 111.75,20.68 111.63,20.8 111.2,20.8 110.5,21.5 110.5,23.31 110.8,23.62 110.8,25.8 111.6,26.6 112.28,26.6 112.4,26.72 112.4,27.89 112.9,28.39 112.9,31.7 113.98,32.78 v113.98,33.05 | D39.C 51.87,20.5 51.26,21.11 49.66,21.11 49.05,20.5 v48.5,20.5
  Bottom 0.254: v212,20.5 D47.C | D46.C v206.5,20.5 | D45.C 183.94,20.5 183.28,21.16 181.64,21.16 180.97,20.5 v180,20.5 | D44.C v165.5,20.5 | D43.C v141,20.5 | D48.C 133.44,20.5 132.78,21.16 130.16,21.16 v129.5,20.5
  other vias: 97.55,43.77
SCK  (via drill 0.35)
  Top 0.152: v88.46,43.54 88.46,50.45 89.84,51.83 89.84,53.33 86.58,56.59 v86.58,58.08
  Bottom 0.152: U1.30 90.55,43.85 89.04,43.85 88.72,43.54 v88.46,43.54 | PROG1.4 80.69,72.59 83.49,69.79 83.49,68.29 83.23,68.03 83.23,61.43 v86.58,58.08
SWD  (via drill 0.35)
  Top 0.152: v85,57.5 86.24,56.26 86.24,51.83 87.99,50.08 87.99,43.35 88.27,43.08 88.65,43.08 88.73,43.15 v88.99,43.15
  Bottom 0.152: U1.28 89.29,43.45 v88.99,43.15 | PROG1.5 79.42,70.56 79.61,70.37 79.61,67.32 79.26,66.98 79.26,63.24 v85,57.5
V_BATT  (via drill 0.35, 0.55)
  Top 0.508: v151.5,53 151.5,39 151.88,39 152.17,38.71 152.83,38.71 153.12,39 v155,39 | v166.4,57.2 v166.4,55.1
  Bottom 0.254: R19.1 156.65,37.15 154.93,35.43 144.27,35.43 142.84,34 132.01,34 130.58,35.43 119,35.43 118.58,35.01 118.58,34.75 116.43,32.6 114.81,32.6 114.6,32.4 114.6,29.68 116.25,28.04 J1.1
  Bottom 0.508: J4.1 144.65,56.9 R15.2 146.48,55.07 148.29,55.07 | IC2.3 149.25,59.25 148.29,58.29 148.29,55.07 | 148.29,55.07 151.69,55.07 | 151.69,55.07 151.69,53.19 v151.5,53 | Q2.2 156.05,40.05 v155,39 155.6,38.4 R19.1 | 151.69,55.07 158.78,55.07 158.81,55.04 166.34,55.04 v166.4,55.1 | X1.2 166.6,57.4 v166.4,57.2
V_RAW
  Bottom 0.406: Q3.2 144.35,41.2 R5.1 146.66,43 D63.1 149.69,42.66 Q5.2 150.4,42.27 VREG.3 | C6.1 153.9,43.55 VREG.3 | VREG.1 151.37,45.13 150.9,45.13 150.68,44.91 150.68,44.09 151.22,43.55 VREG.3
V_USB  (via drill 0.35, 0.55)
  Top 0.152: U1.12 95.29,42.21 95.29,42.54 94.67,43.17 92.81,43.17 91.85,44.13 91.85,44.97 92.45,45.58 92.68,45.58 93.5,46.4 v93.5,48
  Top 0.203: v96.9,64 96.9,66.5 100.4,70 106,70
  Top 0.254: 106,70 119.92,70 121.48,71.56 121.48,71.71 122.29,72.52 124.21,72.52 126.23,70.5 v126.5,70.5 | v126.5,23.5 126.77,23.5 127.06,23.8 150.3,23.8 v150.5,24 | v152.5,39.5 152.9,39.5 153.07,39.67 155.28,39.67 155.67,39.28 155.67,39.03 v157.6,37.1
  Top 0.508: v152.5,39.5 152.5,58.6 v154.3,60.4
  Bottom 0.203: v93.5,48 93.5,54.9 93.5,55.02 93.5,60.6 v96.9,64
  Bottom 0.254: v126.5,70.5 FUSE.1 | LED2.A 115.8,20.85 119.39,20.85 121.86,23.33 126.33,23.33 v126.5,23.5 | v157.6,37.1 153.04,32.54 152.75,32.54 150.5,30.29 v150.5,24
  Bottom 0.406: D63.2 150.11,40.34 Q5.1
  Bottom 0.508: IC2.4 153.5,59.25 C4.1 154.3,58.65 v154.3,60.4 156.57,62.67 | R17.2 159.15,62.5 159.15,58 157.7,58 157.43,58.27 157.43,59.21 156.57,60.06 156.57,62.67 | FUSE.1 126.39,71.54 D67.A 142.2,71.54 144.22,73.56 149.63,73.56 150.21,72.99 150.21,69.9 156.57,63.53 156.57,62.67 | Q5.1 150.95,39.5 v152.5,39.5
  other vias: 95.8,41.7
V_WS2812  (via drill 0.55)
  Top 0.508: v37.5,57 42.04,61.54 62.67,61.54 63.71,60.5 74,60.5 74.25,60.25 | 74.25,60.25 v76,58.5 | 74.25,60.25 77,63 100.74,63 101.14,63.4 106.07,63.4 107.49,61.98 118.72,61.98 120.14,63.4 125.07,63.4 126.49,61.98 126.52,61.98 v130,58.5 135,63.5 142.97,63.5 144.95,65.48 144.95,66.95 146.5,68.5 149,68.5 153,64.5 156.31,64.5 159.05,67.24 159.05,67.52 160.49,68.95 162.45,68.95 162.5,69 171.03,69 174.87,65.17 176.83,65.17 v185,57 186,56 v198,56 | v167,22 167.78,22 169.09,23.31 173.29,23.31 175.1,21.5 v196,21.5 | v132,57 136.98,52.02 139.51,52.02 140.67,50.86 140.67,49.22 140.05,48.6 140.05,46.48 145,41.53 v145,39.5 | v80.5,21.5 79.66,22.34 65.3,22.34 65.28,22.36 65.23,22.36 63.8,23.79 48.38,23.79 46.09,21.5 v43,21.5 20,21.5 v19.5,22
  Bottom 0.508: D84.1 198.38,20.6 199.14,21.36 | 199.14,21.36 200.21,22.43 202.75,22.43 D85.1 209.09,28.77 209.09,32.61 210.5,34.01 212.88,34.01 214.49,35.62 214.49,39.02 214.49,39.03 214.49,39.7 212.17,42.02 210.59,42.02 209.71,42.9 D86.1 203.25,46.08 203.25,48.05 204.2,49.01 204.2,49.3 205.33,49.3 207.21,51.17 207.21,51.8 207.21,53.99 205.19,56 v198,56 | v37.5,57 37.4,56.9 D78.1 33.08,54.56 30.22,54.56 26.67,51.01 26.67,49.22 24.75,47.3 24.75,46.95 23.91,46.1 | v76,58.5 74.4,56.9 D77.1 | v130,58.5 130.42,58.08 D88.1 131.9,56.9 v132,57 | v185,57 187.32,57 D87.1 | D83.1 155.98,22 v167,22 | v196,21.5 199,21.5 199.14,21.36 | Q3.3 144.1,39.5 v145,39.5 | D81.1 42.1,20.6 v43,21.5 | v80.5,21.5 79.6,20.6 D82.1 | v19.5,22 20.52,22 D80.1 20.6,23.79 24.75,27.95 24.75,28.3 26.67,30.22 26.67,43.34 23.91,46.1 | 23.91,46.1 D79.1
VDD_NRF  (via drill 0.35)
  Top 0.152: v89,42.5 91,44.5 91,45.5 91.96,46.46 91.96,48.01 98.95,55 119.61,55 124.83,49.78 131.62,49.78 135.4,46 139.43,46 v140.33,45.1
  Top 0.254: v89,42.5 89.14,42.64 89.21,42.64 89.51,42.94 89.51,43.37 88.79,44.09 88.79,50.31 90.17,51.7 90.17,53.46 89.5,54.14 v89.5,60.5
  Bottom 0.152: U1.26 89.3,42.8 v89,42.5 | PROG1.1 86.24,72.76 86.24,70.83 89.35,67.72 R2.1
  Bottom 0.254: v89.5,60.5 89.35,60.65 R2.1
  Bottom 0.406: D66.A 139.17,43.71 139.17,43.94 v140.33,45.1 143.49,45.1 143.84,45.45 VREG.5
WS2812  (via drill 0.35)
  Top 0.152: v94.82,42.35 94.5,42.67 91.67,42.67 90.6,41.6 82.9,41.6 v81.5,43
  Bottom 0.152: U1.15 v94.82,42.35 | D77.4 90.04,56.9 93.03,53.91 93.03,51.25 91.28,49.49 89.75,49.49 88.59,48.33 88.59,47.06 84.52,43 v81.5,43

## Text on the board
bPlace: + - | + -
200bmp: C:/Users/harry/Downloads/alu40 logo black.bmp
226bmp: C:/Users/harry/Downloads/alu40 logo black.bmp | C:/Users/harry/Downloads/huiben lab icon black.bmp